# Altium project camera_timelapse.PrjPcb
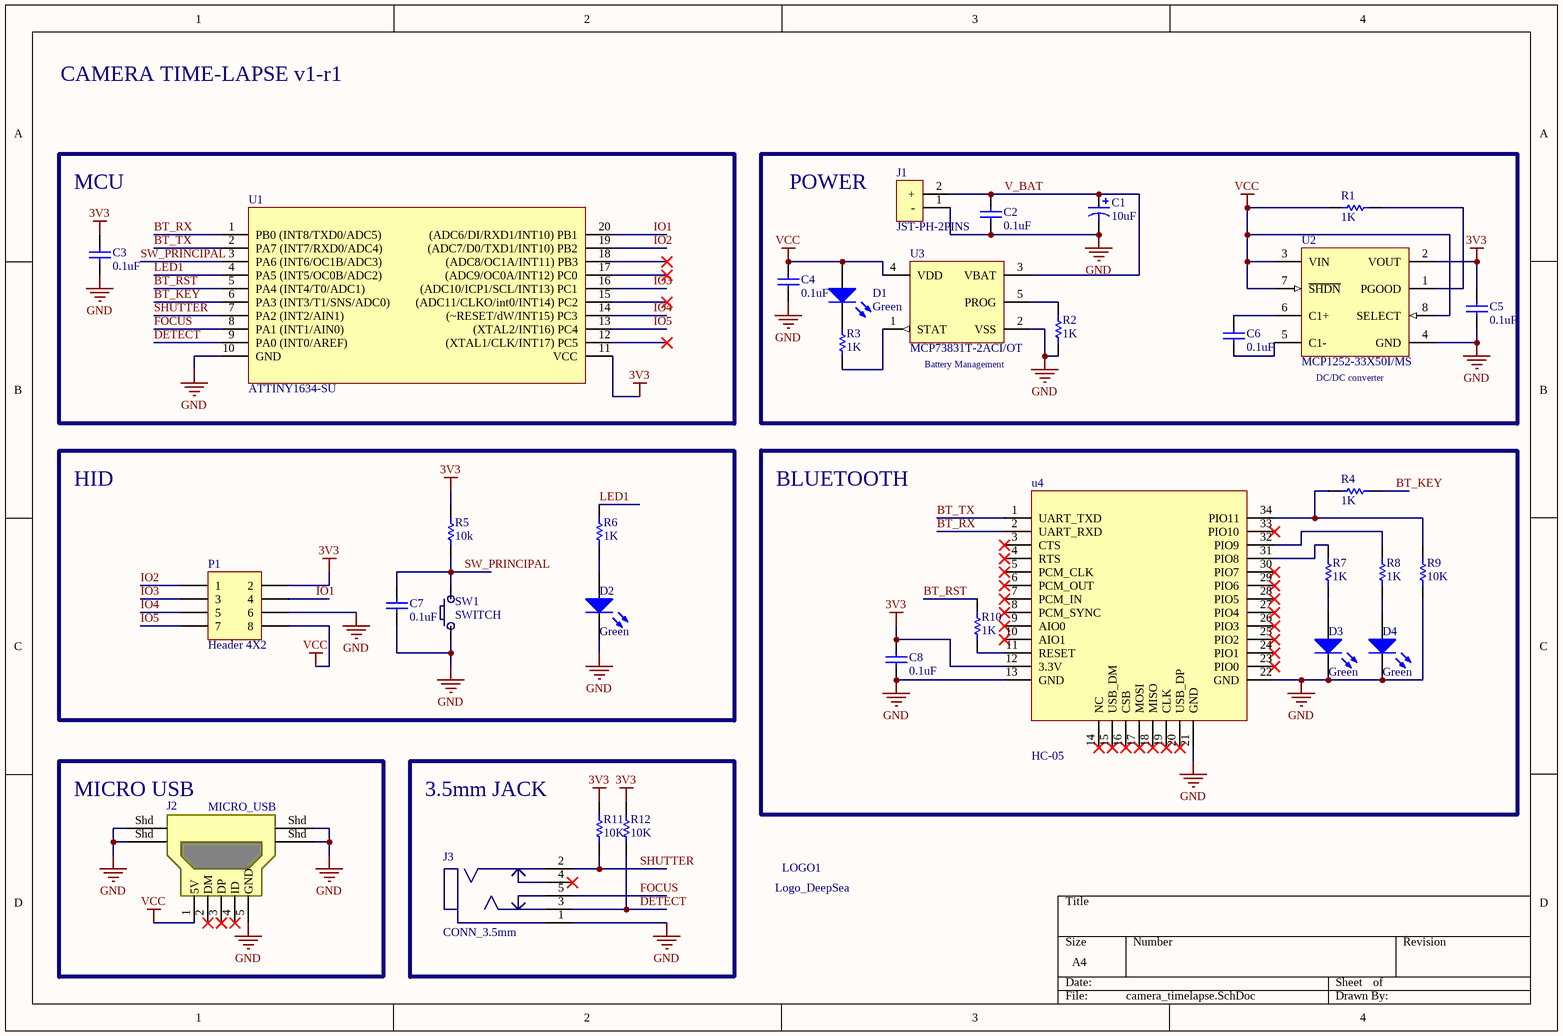
[diagram p0: camera_timelapse.SchDoc]
1 sheet, 34 parts. Net scope: global (net labels, ports and power ports of the same name join across sheets).
Board file: camera_timelapse.PcbDoc

## Sheet camera_timelapse.SchDoc
size A4

### Parts
C1  10uF  [C_TANT_A_3216_N]
C2  0.1uF  [C0603_N]
C3  0.1uF  [C0603_N]
C4  0.1uF  [C0603_N]
C5  0.1uF  [C0603_N]
C6  0.1uF  [C0603_N]
C7  0.1uF  [C0603_N]
C8  0.1uF  [C0603_N]
D1  Green  [R0603_N]
D2  Green  [R0603_N]
D3  Green  [R0603_N]
D4  Green  [R0603_N]
J1  JST-PH-2PINS  [JST-PH-2]
J2  MICRO_USB  [USB MICRO]
J3  CONN_3.5mm  [JACK_3.5MM]
LOGO1  Logo_DeepSea  [DeepSea_logo1]
P1  Header 4X2  [HDR2X4]
R1  1K  [R0603_N]
R2  1K  [R0603_N]
R3  1K  [R0603_N]
R4  1K  [R0603_N]
R5  10k  [R0603_N]
R6  1K  [R0603_N]
R7  1K  [R0603_N]
R8  1K  [R0603_N]
R9  10K  [R0603_N]
R10  1K  [R0603_N]
R11  10K  [R0603_N]
R12  10K  [R0603_N]
SW1  SWITCH  [swich_foot]
U1  ATTINY1634-SU  [SOIC20_L]
U2  MCP1252-33X50I/MS  [MSOP-MS8_L]
U3  MCP73831T-2ACI/OT  [SOT-23-OT5_M]
u4  HC-05  [HC-05]

### Nets
3V3: C3.2 C5.2 C8.2 P1.2 R5.2 R11.1 R12.1 U1.11(VCC) U2.2(VOUT) u4.12(3.3V)
GND: C1.2 C2.1 C3.1 C4.1 C5.1 C7.2 C8.1 D2.2(K) D3.2(K) D4.2(K) J1.1(-) J2.5(GND) J2.Shd J3.1 P1.6 R2.1 R9.2 SW1.1 U1.10(GND) U2.4(GND) U3.2(VSS) u4.13(GND) u4.21(GND) u4.22(GND)
VCC: C4.2 D1.1(A) J2.1(5V) P1.8 R1.2 U2.3(VIN) U2.7(~{SHDN}) U2.8(SELECT) U3.4(VDD)
BT_KEY: R4.1 U1.6(PA3_(INT3/T1/SNS/ADC0))
BT_RST: R10.1 U1.5(PA4_(INT4/T0/ADC1))
BT_RX: U1.1(PB0_(INT8/TXD0/ADC5)) u4.2(UART_RXD)
BT_TX: U1.2(PA7_(INT7/RXD0/ADC4)) u4.1(UART_TXD)
DETECT: J3.3 R12.2 U1.9(PA0_(INT0/AREF))
FOCUS: J3.5 U1.8(PA1_(INT1/AIN0))
IO1: P1.4 U1.20((ADC6/DI/RXD1/INT10)_PB1)
IO2: P1.1 U1.19((ADC7/D0/TXD1/INT10)_PB2)
IO3: P1.3 U1.16((ADC10/ICP1/SCL/INT13)_PC1)
IO4: P1.5 U1.14((~RESET/dW/INT15)_PC3)
IO5: P1.7 U1.13((XTAL2/INT16)_PC4)
LED1: R6.1 U1.4(PA5_(INT5/OC0B/ADC2))
SHUTTER: J3.2 R11.2 U1.7(PA2_(INT2/AIN1))
SW_PRINCIPAL: C7.1 R5.1 SW1.2 U1.3(PA6_(INT6/OC1B/ADC3))
V_BAT: C1.1 C2.2 J1.2(+) U3.3(VBAT)
NetC6_1: C6.1 U2.5(C1-)
NetC6_2: C6.2 U2.6(C1+)
NetD1_2: D1.2(K) R3.1
NetD2_1: D2.1(A) R6.2
NetD3_1: D3.1(A) R7.2
NetD4_1: D4.1(A) R8.2
NetR1_1: R1.1 U2.1(PGOOD)
NetR2_2: R2.2 U3.5(PROG)
NetR3_2: R3.2 U3.1(STAT)
NetR4_2: R4.2 R9.1 u4.34(PIO11)
NetR7_1: R7.1 u4.31(PIO8)
NetR8_1: R8.1 u4.32(PIO9)
NetR10_2: R10.2 u4.11(RESET)

Not connected (* = marked no-connect by the designer): J2 2(DM)* 3(DP)* 4(ID)*; J3 4*; U1 12((XTAL1/CLK/INT17)_PC5)* 15((ADC11/CLKO/int0/INT14)_PC2)* 17((ADC9/OC0A/INT12)_PC0)* 18((ADC8/OC1A/INT11)_PB3)*; u4 3(CTS)* 4(RTS)* 5(PCM_CLK)* 6(PCM_OUT)* 7(PCM_IN)* 8(PCM_SYNC)* 9(AIO0)* 10(AIO1)* 14(NC)* 15(USB_DM)* 16(CSB)* 17(MOSI)* 18(MISO)* 19(CLK)* 20(USB_DP)* 23(PIO0)* 24(PIO1)* 25(PIO2)* 26(PIO3)* 27(PIO4)* 28(PIO5)* 29(PIO6)* 30(PIO7)* 33(PIO10)*

### Notes on the sheet
- CAMERA TIME-LAPSE v1-r1
- MCU
- (near J1) POWER
- Battery Management
- (near U2) DC/DC converter
- HID
- BLUETOOTH
- (near J2) MICRO USB
- (near R11) 3.5mm JACK

### Library data of the parts
C1 = CP_SMD: Value: 10uF
C2-C8 = C_SMD: Value: 0.1uF
D1-D4 = LED_SMD: Color: Green
J1 = JST-PH-2PINS: CONN HEADER PH SIDE 2POS 2MM SMD; Manufacturer: JST Sales America Inc; Manufacturer Part Number: S2B-PH-SM4-TB(LF)(SN); Connector Type: Header, Shrouded; Number of Positions: 2; Number of Positions Loaded: All; Pitch: 0.079" (2.00mm); Supplier 1: Digi-Key; RoHS: RoHS Compliant; Category: Connectors, Interconnects; Stock 1: 51442; Pricing 1: 1=0.56, 10=0.521, 50=0.4168, 100=0.3994, 250=0.36472, 500=0.34734 (USD); Packaging: Cut Tape (CT); Contact Type: Male Pin; Number of Rows: 1; Row Spacing: -; Contact Mating Length: -; Mounting Type: Surface Mount, Right Angle; Termination: Solder; Fastening Type: -; Features: Solder Retention; Contact Finish: Tin; Contact Finish Thickness: -; Color: Natural; ComponentLink1URL: http://www.jst-mfg.com/product/pdf/eng/ePH.pdf; ComponentLink1Description: http://www.jst-mfg.com/product/pdf/eng/ePH.pdf; Supplier Part Number 1: 455-1749-1-ND
J2 = MICRO_USB: CONN USB MICRO B RECPT SMT R/A; Manufacturer: FCI; Manufacturer Part Number: 10118194-0001LF; Connector Type: USB - micro B; Number of Contacts: 5; Gender: Receptacle; Specifications: USB 2.0; Supplier 1: Digi-Key; RoHS: RoHS Compliant; Category: Connectors, Interconnects; Stock 1: 9139; Pricing 1: 1=0.46, 10=0.433, 25=0.3712, 50=0.3156, 100=0.3032, 250=0.27224, 500=0.25988 (USD); Packaging: Cut Tape (CT); Mounting Type: Surface Mount, Right Angle, Horizontal; Features: Shielded, Solder Retention; Ingress Protection: -; ComponentLink1URL: http://portal.fciconnect.com/Comergent//fci/drawing/10118194.pdf; ComponentLink1Description: http://portal.fciconnect.com/Comergent//fci/drawing/10118194.pdf; Supplier Part Number 1: 609-4618-1-ND
J3 = CONN_3.5mm: CONN JACK STEREO 3.5MM SMD; Manufacturer: Switchcraft Inc.; Manufacturer Part Number: 35RASMT4BHNTRX; Connector Type: Phone Jack; Gender: Female; Plug/Mating Plug Diameter: 3.50mm (0.141", 1/8", Mini Plug) - Headphone; Number of Positions/Contacts: 3 Conductors, 5 Contacts; Internal Switch(s): Two Switches; Shielding: Unshielded; Color - Contact: Gold; Voltage - Rated: 250VAC; Current Rating: 3A; Supplier 1: Digi-Key; RoHS: RoHS Compliant; Category: Connectors, Interconnects; Stock 1: 3537; Pricing 1: 1=0.65 (USD); Signal Lines: Stereo; Mounting Type: Surface Mount, Right Angle; Termination: Solder; Features: -; Contact Material: Copper Alloy; Contact Material - Plating: Silver; Housing Material: Thermoplastic; Housing Color: Black; Operating Temperature: -25°C ~ 85°C; Packaging: Digi-Reel®; ComponentLink1URL: http://www.switchcraft.com/Drawings/35rasmt4bhntrx_cd.pdf; ComponentLink1Description: http://www.switchcraft.com/Drawings/35rasmt4bhntrx_cd.pdf; Supplier Part Number 1: SC1488-6-ND
P1 = Header 4X2: Header, 4-Pin, Dual row; LatestRevisionDate: 17-Jul-2002; LatestRevisionNote: Re-released for DXP Platform.; Publisher: Altium Limited
R1-R12 = R_SMD
  R1-R4 R6-R8 R10: Value: 1K
  R5: Value: 10k
  R9 R11 R12: Value: 10K
SW1 = SWITCH: SWITCH TACTILE SPST-NO 0.05A 12V; Manufacturer: TE Connectivity; Manufacturer Part Number: FSM4JSMATR; Switch Function: Off-Mom; Contact Rating @ Voltage: 0.05A @ 12VDC; Actuator Type: Standard; Actuator Height off PCB, from Pins: 5.00mm; Actuator Orientation: Top Actuated; Outline: 6.00mm x 6.00mm; Illumination: Non-Illuminated; Operating Force: 160gf; Actuator Material: Polyphenylene Sulfide (PPS); Switch Travel: 0.25mm; Mechanical Life: 100,000 Cycles; Supplier 1: Digi-Key; RoHS: RoHS Compliant; Category: Switches; Stock 1: 33712; Pricing 1: 1=0.23, 10=0.223, 25=0.2136, 50=0.2038, 100=0.1843, 250=0.1698, 500=0.15524 (USD); Packaging: Cut Tape (CT); Circuit: SPST-NO; Mounting Type: Surface Mount; Termination Style: Gull Wing; Illumination Voltage (Nominal): -; Illumination Type, Color: -; Ingress Protection: -; Features: -; Operating Temperature: -35°C ~ 85°C; ComponentLink1URL: http://www.te.com/commerce/DocumentDelivery/DDEController?Action=srchrtrv&DocNm=2-1437565-7&DocType=Customer+Drawing&DocLang=English; ComponentLink1Description: http://www.te.com/commerce/DocumentDelivery/DDEController?Action=srchrtrv&DocNm=2-1437565-7&DocType=Customer+Drawing&DocLang=English; Supplier Part Number 1: 450-1759-1-ND
U1 = ATTINY1634-SU: IC MCU 8BIT 16KB FLASH 20SOIC; Manufacturer: Atmel; Core Processor: AVR; Core Size: 8-Bit; Speed: 12MHz; Connectivity: I²C, SPI, UART/USART, USI; Peripherals: Brown-out Detect/Reset, POR, PWM, WDT; Number of I /O: 18; Program Memory Size: 16KB (16K x 8); EEPROM Size: 256 x 8; RAM Size: 1K x 8; Voltage - Supply (Vcc/Vdd): 1.8 V ~ 5.5 V; Data Converters: A/D 12x10b; Oscillator Type: Internal; Supplier 1: Digi-Key; Manufacturer Part Number: ATTINY1634-SU; RoHS: RoHS Compliant; Category: Integrated Circuits (ICs); Stock 1: 0; Pricing 1: 1=1.76, 25=1.12, 100=1 (USD); Packaging: Tube; Program Memory Type: FLASH; Operating Temperature: -40°C ~ 85°C; Package / Case: 20-SOIC (0.295", 7.50mm Width); ComponentLink1URL: http://www.atmel.com/Images/Atmel-8303-8-bit-AVR-Microcontroller-tinyAVR-ATtiny1634_Datasheet_summary.pdf; ComponentLink1Description: http://www.atmel.com/Images/Atmel-8303-8-bit-AVR-Microcontroller-tinyAVR-ATtiny1634_Datasheet_summary.pdf; Supplier Part Number 1: ATTINY1634-SU-ND
U2 = MCP1252-33X50I/MS: IC REG MULTI CONFIG 0.12A 8MSOP; Manufacturer: Microchip Technology; Output Type: Fixed; Number of Outputs: 1; Voltage - Output: 3.3V, 5V; Voltage - Input: 2 V ~ 5.5 V; Frequency - Switching: 650kHz; Current - Output: 120mA; Synchronous Rectifier: No; Supplier 1: Digi-Key; RoHS: RoHS Compliant; Category: Integrated Circuits (ICs); Stock 1: 1865; Pricing 1: 1=1.64, 10=1.37, 25=1.14, 100=1.04 (USD); Packaging: Tube; Type: Step-Down (Buck), Step-Up (Boost), Switched Capacitor (Charge Pump); PWM Type: -; Operating Temperature: -40°C ~ 85°C; Mounting Type: Surface Mount; Package / Case: 8-TSSOP, 8-MSOP (0.118", 3.00mm Width); Supplier Device Package: 8-MSOP; ComponentLink1URL: http://www.microchip.com/mymicrochip/filehandler.aspx?ddocname=en011637; ComponentLink1Description: http://www.microchip.com/mymicrochip/filehandler.aspx?ddocname=en011637; Supplier Part Number 1: MCP1252-33X50I/MS-ND; Manufacturer Part Number: MCP1252-33X50I/MS
U3 = MCP73831T-2ACI/OT: IC CONTROLLR LI-ION 4.2V SOT23-5; Manufacturer: Microchip Technology; Function: Charge Management; Battery Chemistry: Li-Ion, Li-Pol; Voltage - Supply: 3.75 V ~ 6 V; Supplier 1: Digi-Key; RoHS: RoHS Compliant; Category: Integrated Circuits (ICs); Stock 1: 15473; Pricing 1: 1=0.67, 10=0.56, 25=0.47, 100=0.42 (USD); Packaging: Cut Tape (CT); Operating Temperature: -40°C ~ 85°C; Mounting Type: Surface Mount; Package / Case: SC-74A, SOT-753; Supplier Device Package: SOT-23-5; ComponentLink1URL: http://www.microchip.com/mymicrochip/filehandler.aspx?ddocname=en025112; ComponentLink1Description: http://www.microchip.com/mymicrochip/filehandler.aspx?ddocname=en025112; Supplier Part Number 1: MCP73831T-2ACI/OTCT-ND; Manufacturer Part Number: MCP73831T-2ACI/OT
u4 = HC-05: Bluetooth RS232 module